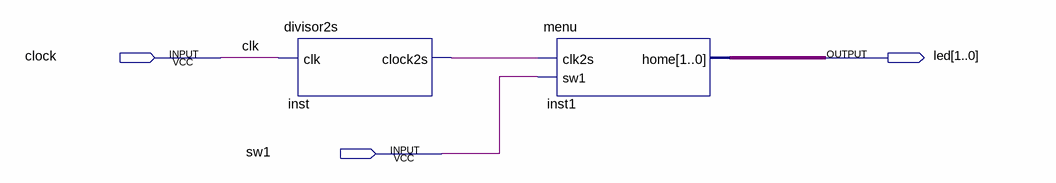
[diagram p0: schematic sheet]
// Quartus schematic testemenu.bdf as structural Verilog: 2 symbols, 3 pins
module testemenu (
  input  clock,
  input  sw1,
  output [1:0] led
);

  wire inst_clock2s;

  divisor2s inst (.clk(clock), .clock2s(inst_clock2s));
  menu inst1 (.clk2s(inst_clock2s), .sw1(sw1), .home(led));

  // Other names for the same wires on the sheet: clk = clock
endmodule
